# EAGLE design Actuator Circle (EAGLE 9.4.2)
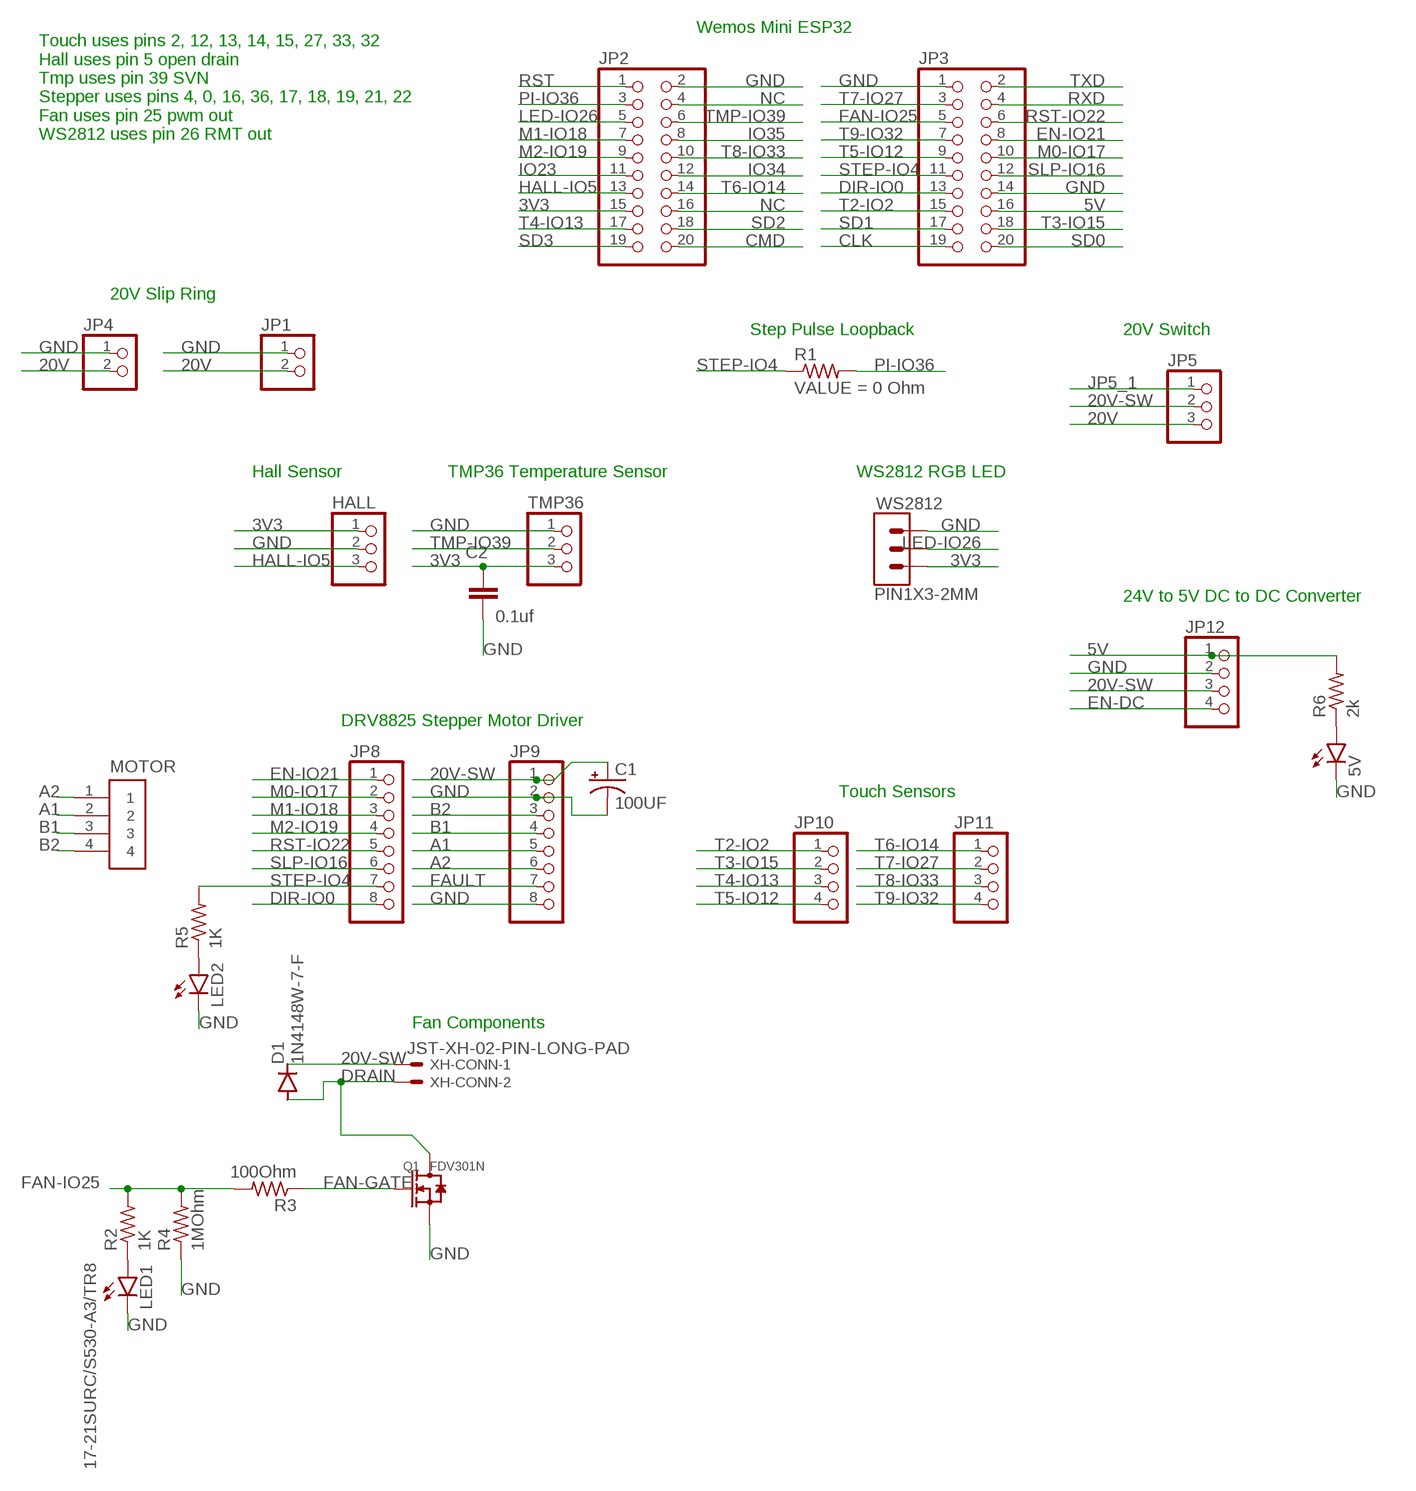
[diagram p0: schematic, sheet 1]

## Parts
5V  17-21SURC/S530-A3/TR8  LEDCHIPLED_0805  [CHIPLED_0805]
C1  100UF  CAPACITOR-PE2.5-6  [E2,5-6]
C2  0.1uf  CAP-0603-22UF-10V-MLCC  [CAP_0603]
D1  1N4148W-7-F  D-SOD123  [SOD123]
HALL  PINHD-1X3  [1X03]
JP1  PINHD-1X2  [1X02]
JP2  PINHD-2X10  [2X10]
JP3  PINHD-2X10  [2X10]
JP4  PINHD-1X2  [1X02]
JP5  PINHD-1X3/90  [1X03/90]
JP8  PINHD-1X8  [1X08]
JP9  PINHD-1X8  [1X08]
JP10  PINHD-1X4  [1X04]
JP11  PINHD-1X4  [1X04]
JP12  PINHD-1X4  [1X04]
LED1  17-21SURC/S530-A3/TR8  LEDCHIPLED_0805  [CHIPLED_0805]
LED2  17-21SURC/S530-A3/TR8  LEDCHIPLED_0805  [CHIPLED_0805]
MOTOR  B4B-PH-K-S(LF)(SN)  [JST_B4B-PH-K-S(LF)(SN)]
Q1  FDV301N  SMD-MOSFET-N-CH-25V-220MA-FDV301N(SOT-23)  [SOT23]
R1  0 Ohm  RES-0402  [RES_0402]
R2  1K  RES-0402  [RES_0402]
R3  100Ohm  RES-0402  [RES_0402]
R4  1MOhm  RES-0402  [RES_0402]
R5  1K  RES-0402  [RES_0402]
R6  2k  RES-0402  [RES_0402]
TMP36  PINHD-1X3  [1X03]
WS2812  PIN1X3-2MM  [PIN1X3-2MM]
XH-CONN  JST-XH-02-PIN-LONG-PAD  [JST-XH-02-PACKAGE-LONG-PAD]

## Nets
3V3: C2.1 HALL.1 JP2.15 TMP36.3 WS2812.3
5V: JP3.16 JP12.1 R6.2
20V: JP1.2 JP4.2 JP5.3
20V-SW: C1.+ D1.1(C) JP5.2 JP9.1 JP12.3 XH-CONN.1
A1: JP9.5 MOTOR.2
A2: JP9.6 MOTOR.1
B1: JP9.4 MOTOR.3
B2: JP9.3 MOTOR.4
CLK: JP3.19
CMD: JP2.20
DIR-IO0: JP3.13 JP8.8
DRAIN: D1.2(A) Q1.3(D) XH-CONN.2
EN-DC: JP12.4
EN-IO21: JP3.8 JP8.1
FAN-GATE: Q1.1(G) R3.1
FAN-IO25: JP3.5 R2.2 R3.2 R4.2
FAULT: JP9.7
GND [gndplane]: 5V.C C1.- C2.2 HALL.2 JP1.1 JP2.2 JP3.1 JP3.14 JP4.1 JP9.2 JP9.8 JP12.2 LED1.C LED2.C Q1.2(S) R4.1 TMP36.1 WS2812.1
HALL-IO5: HALL.3 JP2.13
IO23: JP2.11
IO34: JP2.12
IO35: JP2.8
JP5_1: JP5.1
LED-IO26: JP2.5 WS2812.2
M0-IO17: JP3.10 JP8.2
M1-IO18: JP2.7 JP8.3
M2-IO19: JP2.9 JP8.4
N$1: LED1.A R2.1
N$2: LED2.A R5.1
N$3: 5V.A R6.1
NC: JP2.4 JP2.16
PI-IO36: JP2.3 R1.2
RST: JP2.1
RST-IO22: JP3.6 JP8.5
RXD: JP3.4
SD0: JP3.20
SD1: JP3.17
SD2: JP2.18
SD3: JP2.19
SLP-IO16: JP3.12 JP8.6
STEP-IO4: JP3.11 JP8.7 R1.1 R5.2
T2-IO2: JP3.15 JP10.1
T3-IO15: JP3.18 JP10.2
T4-IO13: JP2.17 JP10.3
T5-IO12: JP3.9 JP10.4
T6-IO14: JP2.14 JP11.1
T7-IO27: JP3.3 JP11.2
T8-IO33: JP2.10 JP11.3
T9-IO32: JP3.7 JP11.4
TMP-IO39: JP2.6 TMP36.2
TXD: JP3.2

## Notes on the sheet
- Wemos Mini ESP32
- Touch uses pins 2, 12, 13, 14, 15, 27, 33, 32
  Hall uses pin 5 open drain
  Tmp uses pin 39 SVN
  Stepper uses pins 4, 0, 16, 36, 17, 18, 19, 21, 22
  Fan uses pin 25 pwm out
  WS2812 uses pin 26 RMT out
- 20V Slip Ring
- Step Pulse Loopback | 20V Switch
- Hall Sensor | TMP36 Temperature Sensor | WS2812 RGB LED
- 24V to 5V DC to DC Converter
- DRV8825 Stepper Motor Driver
- Touch Sensors
- Fan Components

## Library data of the parts
5V LED1 LED2 = Actuator Circle:LED: LED OSRAM: - CHIPLED LG R971, LG N971, LY N971, LG Q971, LY Q971, LO R971, LY R971 LH N974, LH R974 LS Q976, LO Q976, LY Q976 LO Q996 - Hyper CHIPLED LW Q18S LB Q993, LB Q99A, LB R99A - SideLED LS A670, LO A670, LY A670, LG A670, LP A670 LB A673, LV A673, LT A673, LW A673 LH A674 LY A675 LS A676, LA A676, LO A676, LY A676, LW A676 LS A679, LY A679, LG A679 - Hyper Micro SIDELED® LS Y876, LA Y876, LO Y876, LY Y876 LT Y87S - SmartLED LW L88C, LW L88S LB L89C, LB L89S, LG L890 LS L89K, LO L89K, LY L89K LS L896, LA L896, LO L896, LY L896 - TOPLED LS T670, LO T670, LY T670, LG T670, LP T670 LSG T670, LSP T670, LSY T670, LOP T670, LYG T670 LG T671, LOG T671, LSG T671 LB T673, LV T673, LT T673, LW T673 LH T674 LS T676, LA T676, LO T676, LY T676, LB T676, LH T676, LSB T676, LW T676 LB T67C, LV T67C, LT T67C, LS T67K, LO T67K, LY T67K, LW E67C LS E67B, LA E67B, LO E67B, LY E67B, LB E67C, LV E67C, LT E67C LW T67C LS T679, LY T679, LG T679 LS T770, LO T770, LY T770, LG T770, LP T770 LB T773, LV T773, LT T773, LW T773 LH T774 LS E675, LA E675, LY E675, LS T675 LS T776, LA T776, LO T776, LY T776, LB T776 LHGB T686 LT T68C, LB T68C - Hyper Mini TOPLED® LB M676 - Mini TOPLED Santana® LG M470 LS M47K, LO M47K, LY M47K Source: http://www.osram.convergy.de LUXEON: - LUMILED® LXK2-PW12-R00, LXK2-PW12-S00, LXK2-PW14-U00, LXK2-PW14-V00 LXK2-PM12-R00, LXK2-PM12-S00, LXK2-PM14-U00 LXK2-PE12-Q00, LXK2-PE12-R00, LXK2-PE12-S00, LXK2-PE14-T00, LXK2-PE14-U00 LXK2-PB12-K00, LXK2-PB12-L00, LXK2-PB12-M00, LXK2-PB14-N00, LXK2-PB14-P00, LXK2-PB14-Q00 LXK2-PR12-L00, LXK2-PR12-M00, LXK2-PR14-Q00, LXK2-PR14-R00 LXK2-PD12-Q00, LXK2-PD12-R00, LXK2-PD12-S00 LXK2-PH12-R00, LXK2-PH12-S00 LXK2-PL12-P00, LXK2-PL12-Q00, LXK2-PL12-R00 Source: www.luxeon.com KINGBRIGHT: KA-3528ASYC Source: www.kingbright.com
C1 = BeagleBone_Blue_R3:CAPACITOR-P: POLARIZED CAPACITOR, American symbol
C2 = Actuator Circle:CAP-0603-22UF-10V-MLCC: Multilayer Ceramic Capacitors MLCC - SMD/SMT 22uF 10V 0603 RoHS LCSC LINK <https://lcsc.com/product-detail/Multilayer-Ceramic-Capacitors-MLCC-SMD-SMT_SAMSUNG_CL10A226MP8NUNE_22uF-226-20-10V_C86295.html>; CREATED_BY: ChiliPeppr; DIGIKEY_PART_NUMBER: LCSC Part #: C86295; MANUFACTURER: Samsung Electro-Mechanics; MPN: CL10A226MP8NUNE; PACKAGE: SMD 0603
D1 = Actuator Circle:D-: DIODE unfilled
HALL TMP36 = pinhead:PINHD-1X3: PIN HEADER
JP1 JP4 = pinhead:PINHD-1X2: PIN HEADER
JP2 JP3 = pinhead:PINHD-2X10: PIN HEADER
JP5 = Actuator Circle:PINHD-1X3: PIN HEADER
JP8 JP9 = pinhead:PINHD-1X8: PIN HEADER
JP10-JP12 = pinhead:PINHD-1X4: PIN HEADER
MOTOR = B4B-PH-K-S_LF__SN_:B4B-PH-K-S(LF)(SN): PH Series 4 Position 2 mm Pitch Through Hole Crimp Top Entry Shrouded Header; AVAILABILITY: Unavailable; DESCRIPTION: PH Series 4 Position 2 mm Pitch Through Hole Crimp Top Entry Shrouded Header; MF: JST Sales; MP: B4B-PH-K-S_LF__SN_; PACKAGE: None; PRICE: None
Q1 = Actuator Circle:SMD-MOSFET-N-CH-25V-220MA-FDV301N(SOT-23): FDV301N https://datasheet.lcsc.com/szlcsc/ON-Semicon-ON-FDV301N_C15310.pdf Package SOT-23(SOT-23-3) Manufacturer ON Semicon Brand Category International Brands FET Type N Trench Drain to Source Voltage(Vdss) 25V Continuous Drain Current (Id) @ 25°C 220mA Vgs(th) (Max) @ Id 1.06V @ 250uA Rds On (Max) @ Id, Vgs 4 Ω @ 400mA,4.5V Power Dissipation-Max (Ta) 350mW; MPN: FDV301N
R1 = robot actuator:RES-0402: RES SMD 0402; CREATED_BY: ChiliPeppr; PACKAGE: SMD 0402
R2-R6 = Actuator Circle:RES-0402: RES SMD 0402; CREATED_BY: ChiliPeppr; PACKAGE: SMD 0402
WS2812 = Actuator Circle:PIN1X3-2MM: THT Vertical Pin Header WR-PHD, Pitch 2.00 mm, Single Row, 3 pins Manufacturer's datasheet <https://datasheet.octopart.com/62000311121-W%C3%BCrth-Elektronik-datasheet-117282002.pdf>; CREATED_BY: PCBLayout.com; MANUFACTURER: Würth Elektronik; MPN: 62000311121
XH-CONN = Actuator Circle:JST-XH-02-PIN: JST XH Connector 2 Pin Wire to board connector. Pitch: 2,54 mm, (0.100") Number of pins: 2 Created by Rembrandt Electronics www.rembrandtelectronics.com

## Net classes
1 gndplane: clearance 0.152 mm

## Board
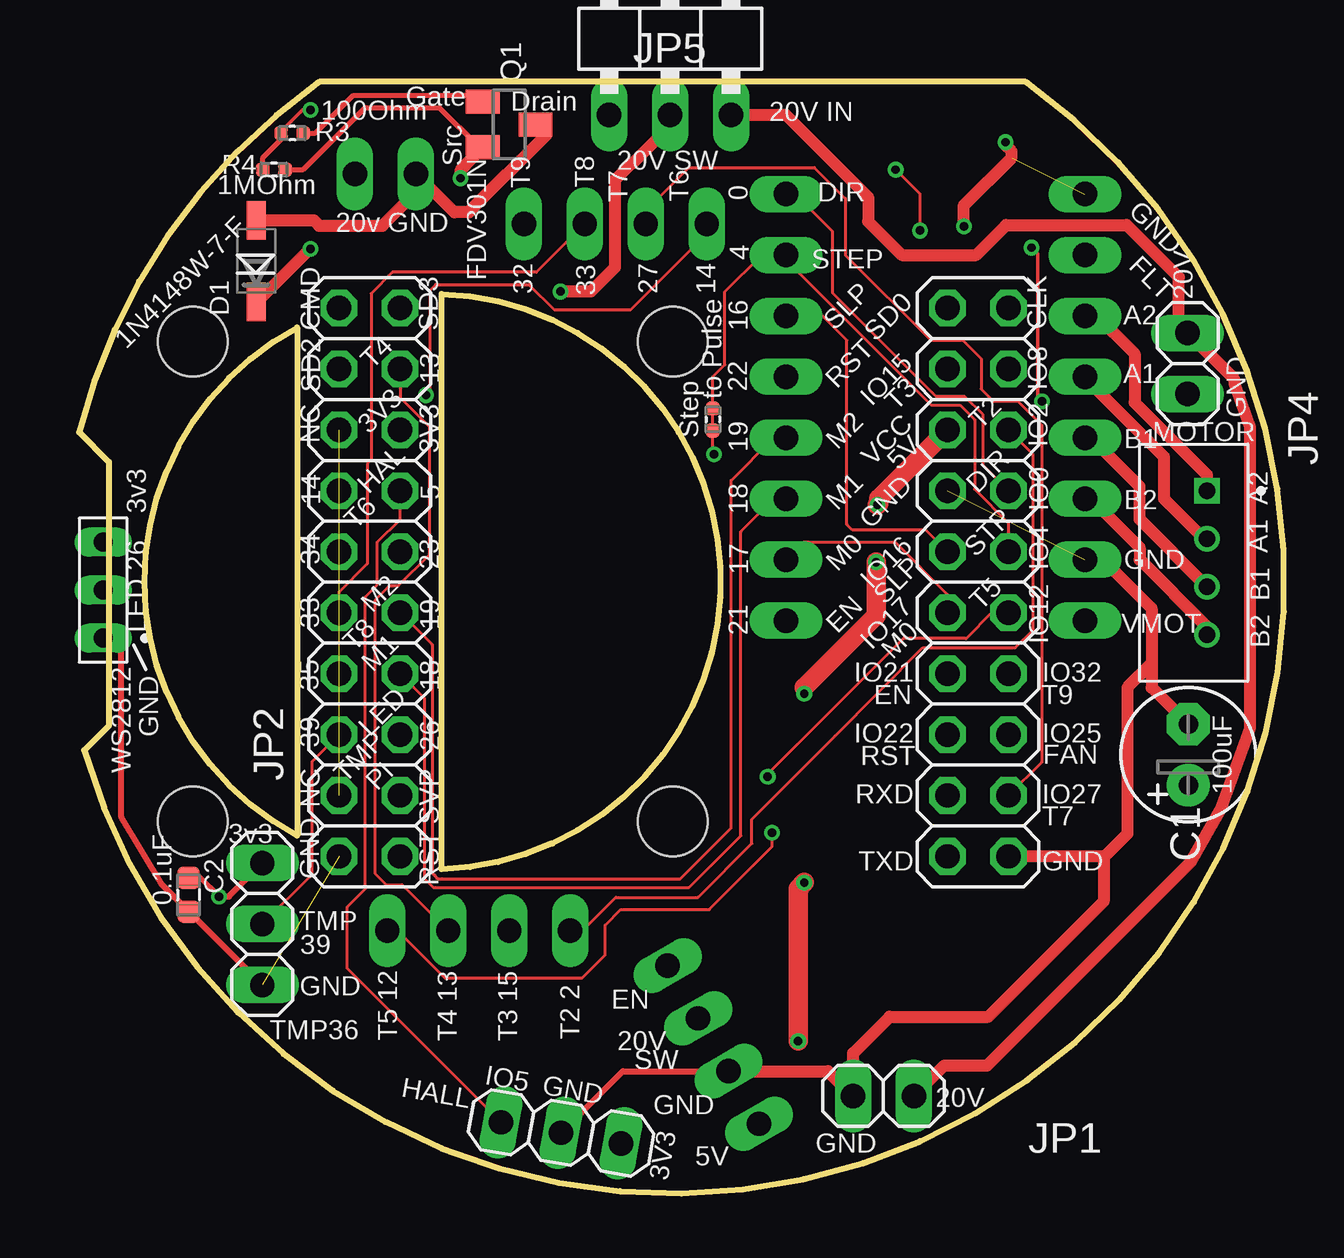
[diagram p1: board, top side]
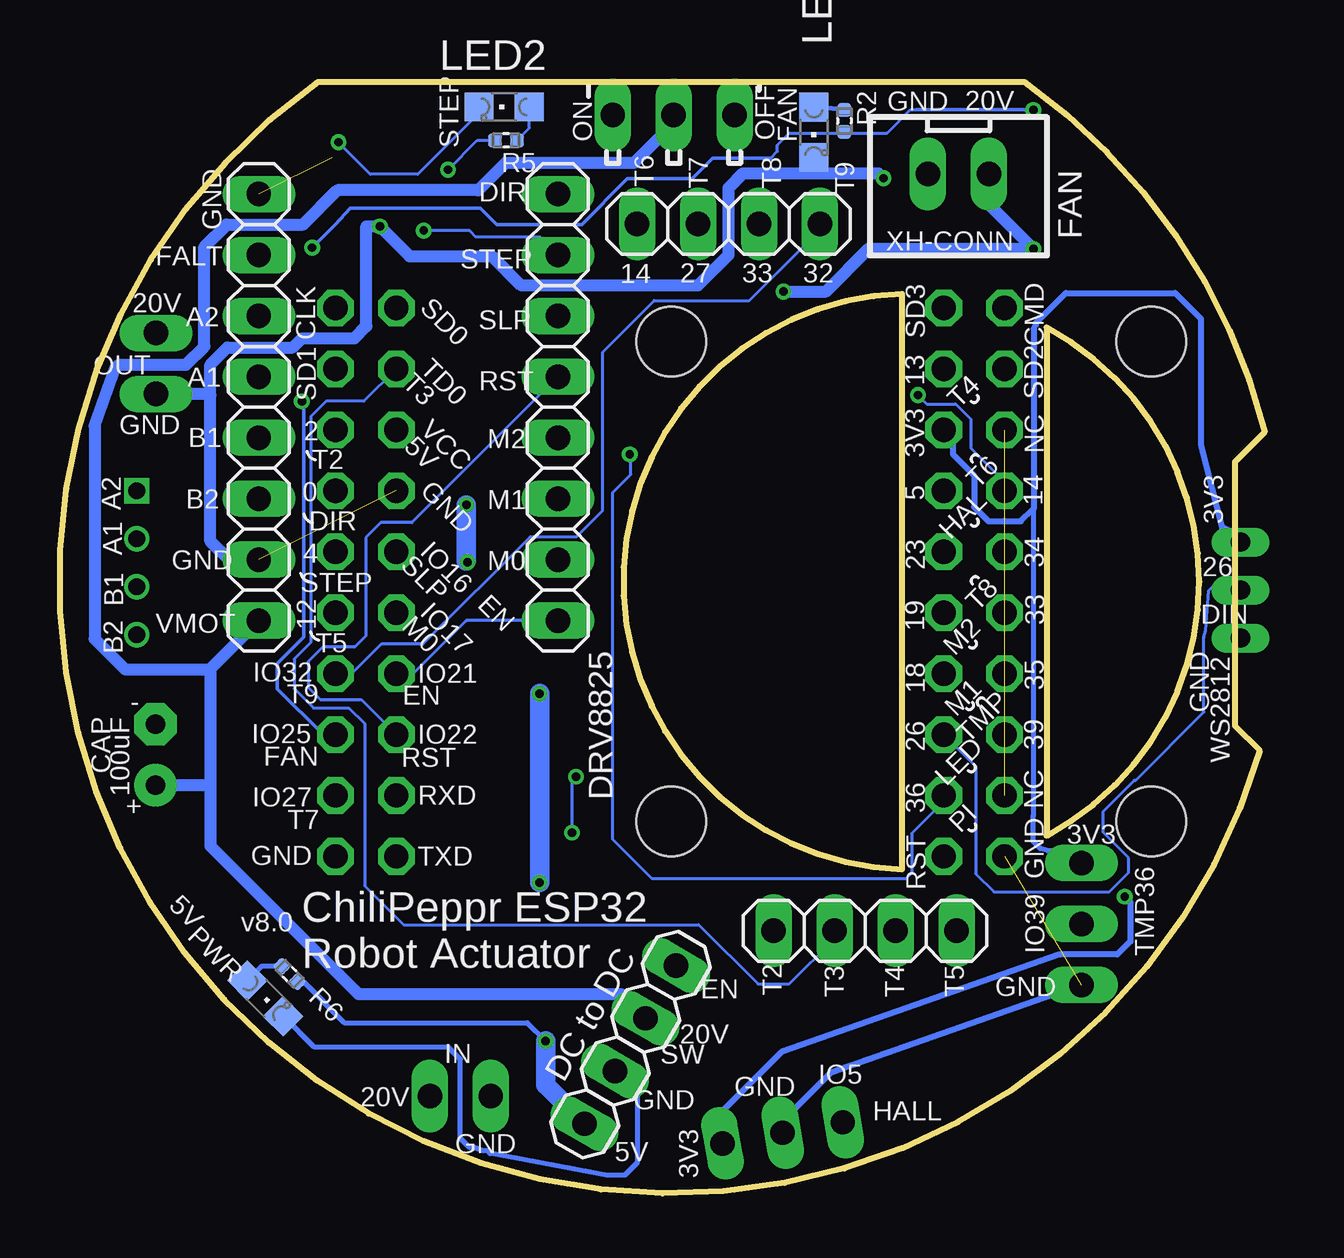
[diagram p2: board, bottom side, seen from below]

Size 50.2 x 46.32 mm. Coordinates in mm from the lower left corner, seen from the top.
Outline: 10.02,46.32 arc41 0,31.73 1.24,30.49 1.24,19.49 0.21,18.47 arc219 39.44,46.32 10.02,46.32
Outline: 9.08,14.91 arc-124 9.08,36.09 9.08,14.91
Outline: 15.11,37.49 arc-176 15.11,13.5 15.11,37.49
Copper layers (1*16): Top 0.035mm / dielectric 0.93mm / Bottom 0.035mm
Design rules "default *": minimum track width 5mil, minimum drill 0.3mm, track to track 5mil, track to pad 5mil, pad to pad 5mil, via to via 5mil, smd to smd 5mil, copper to edge 0.2mm, drill to drill 6mil, minimum pad ring 6mil, minimum via ring 6mil, stop-mask expansion 4mil, vias tented up to drill 0mil, thermal gap 10mil
Holes 2.9 mm at 4.73,15.5 24.73,15.5 4.73,35.5 24.73,35.5

### Footprints (pad centres in the part's own frame; a part is rotated, then mirrored left to right if it is on the bottom)
CHIPLED_0805 = smd 1.2 x 1.2: A 0,-1.05; C 0,1.05
E2,5-6 = drill 0.813 pad 1.778: + -1.27,0 | drill 0.813 pad 1.778 octagon: - 1.27,0
CAP_0603 = smd 0.92 x 0.93: 1 -0.705,0; 2 0.705,0
SOD123 = smd 1.6 x 0.8: 1 -1.7,0; 2 1.7,0
1X03 = drill 1.016 long: 1 -2.54,0; 2 0,0; 3 2.54,0
1X02 = drill 1.016 long: 1 -1.27,0; 2 1.27,0
2X10 = drill 1.016 octagon: 1 -11.43,-1.27; 2 -11.43,1.27; 3 -8.89,-1.27; 4 -8.89,1.27; 5 -6.35,-1.27; 6 -6.35,1.27; 7 -3.81,-1.27; 8 -3.81,1.27; 9 -1.27,-1.27; 10 -1.27,1.27; 11 1.27,-1.27; 12 1.27,1.27; 13 3.81,-1.27; 14 3.81,1.27; 15 6.35,-1.27; 16 6.35,1.27; 17 8.89,-1.27; 18 8.89,1.27; 19 11.43,-1.27; 20 11.43,1.27
1X03/90 = drill 1.016 long: 1 -2.54,-3.81; 2 0,-3.81; 3 2.54,-3.81
1X08 = drill 1.016 long: 1 -8.89,0; 2 -6.35,0; 3 -3.81,0; 4 -1.27,0; 5 1.27,0; 6 3.81,0; 7 6.35,0; 8 8.89,0
1X04 = drill 1.016 long: 1 -3.81,0; 2 -1.27,0; 3 1.27,0; 4 3.81,0
JST_B4B-PH-K-S(LF)(SN) = drill 0.7 square: 1 3,-0.55 | drill 0.7: 2 1,-0.55; 3 -1,-0.55; 4 -3,-0.55
SOT23 = smd 1 x 1.4: 1 -0.95,-1.1; 2 0.95,-1.1; 3 0,1.1
RES_0402 = smd 0.58 x 0.58: 1 -0.46,0; 2 0.46,0
PIN1X3-2MM = drill 0.8 long: 1 -2,0; 2 0,0; 3 2,0
JST-XH-02-PACKAGE-LONG-PAD = drill 1.016 long: 1 -1.27,0; 2 1.27,0

### Placement (x,y rotation side)
5V  41.64,8.12 225 bottom
C1  46.22,18.28 90 top
C2  4.56,12.44 270 top
D1  7.38,38.86 90 top
HALL  20.08,2.52 170 top
JP1  33.52,4.06 0 top
JP2  12.1,25.47 90 top
JP3  37.45,25.47 90 top
JP4  46.19,34.59 90 top
JP5  24.63,48.76 0 top
JP8  29.45,32.76 90 bottom
JP9  41.91,32.76 90 bottom
JP10  16.65,10.94 0 bottom
JP11  22.34,40.41 0 bottom
JP12  26.43,6.19 60 bottom
LED1  18.79,44.23 180 bottom
LED2  31.69,45.29 90 bottom
MOTOR  46.45,26.29 90 top
Q1  17.92,44.55 270 top
R1  26.41,32.25 270 top
R2  17.52,44.7 270 bottom
R3  8.88,44.19 180 top
R4  8.12,42.67 180 top
R5  31.61,43.89 180 bottom
R6  40.63,9.14 315 bottom
TMP36  7.63,11.22 90 top
WS2812  1,25.14 90 top
XH-CONN  12.77,42.49 180 bottom

### Tracks (layer width: path | path; a pad name or v marks a point on that pad's centre or on a via)
3V3  (via drill 0.35)
  Top 0.203: v5.83,12.37 5.05,13.15 C2.1
  Top 0.254: TMP36.3 6.24,12.37 v5.83,12.37
  Bottom 0.203: WS2812.3 1.54,27.68 1.77,27.68 | 9.64,28.53 9.64,15.74 9.65,15.74 9.65,14.66 9.36,14.37 9.03,14.27 8.14,14.27 TMP36.3
  Bottom 0.254: JP2.15 12.99,31.44 12.99,30.8 12.11,29.92 12.11,28.61 11.51,28.01 10.16,28.01 9.64,28.53 9.61,28.56 9.61,36.02 9.62,36.04 9.54,36.2 9.54,36.27 9.45,36.36 9.4,36.47 9.33,36.49 8.29,37.53 3.74,37.53 2.66,36.45 2.66,31.19 1.77,27.68 1.69,27.61 1.69,27.66 | 1.69,27.66 1.69,27.73 1.77,27.73 1.69,27.66 | HALL.1 22.59,3.44 20.13,5.89 8.54,9.95 6.15,9.95 5.6,10.5 5.6,12.14 v5.83,12.37
5V  (via drill 0.35)
  Top 0.254: 30.21,21.08 v30.21,20.82
  Top 0.813: JP3.16 33.31,28.95 33.31,28.75 v33.26,28.7 | v33.21,26.31 33.21,24.08 30.21,21.08 | v30.21,12.95 29.96,12.7 v29.96,6.35
  Bottom 0.203: R6.2 40.05,8.82 38.34,7.11 30.72,7.11 v29.96,6.35
  Bottom 0.508: 33.26,26.36 v33.21,26.31
  Bottom 0.813: v33.26,28.7 33.26,26.36 | v30.21,20.82 v30.21,12.95 | v29.96,6.35 29.96,4.52 JP12.1
20V
  Top 0.508: JP5.3 29.45,44.95 32.88,41.53 32.88,40.51 34.28,39.11 37.38,39.11 38.62,40.36 43.65,40.36 45.82,38.19 45.82,36.23 JP4.2 48.14,33.91 48.14,33.74 48.8,31.94 48.8,19.39 47.61,16.1 46.29,13.79 37.83,5.33 36.06,5.33 JP1.2
20V-SW  (via drill 0.35)
  Top 0.508: JP5.2 24.63,44.5 23.05,42.92 23.01,42.92 22.32,42.23 22.32,38.59 21.32,37.59 v20.05,37.59 | v9.64,39.37 7.43,37.16 D1.1
  Bottom 0.508: JP5.2 24.63,44.61 26.29,42.95 31.64,42.95 32.78,41.8 38.63,41.8 40.06,40.38 43.26,40.38 44.18,39.46 44.18,35.3 44.95,34.54 47.74,34.54 47.89,34.39 48.76,32 48.76,23.11 47.49,21.84 43.93,21.84 | 43.93,21.84 43.93,17.01 | 43.93,17.01 43.93,14.47 37.77,8.31 26.81,8.31 JP12.3 | JP9.1 43.93,21.85 43.93,21.84 | XH-CONN.1 11.5,41.22 v9.64,39.37 16.5,39.37 18.28,37.59 v20.05,37.59 | C1.+ 43.93,17.01
A1
  Top 0.508: JP9.5 41.91,33.99 45.2,30.71 45.2,28.95 46.87,27.29 MOTOR.2
A2
  Top 0.508: JP9.6 42.4,36.57 43.06,35.91 43.07,35.91 43.98,35 43.98,32.97 47,29.95 MOTOR.1
B1
  Top 0.508: MOTOR.3 44.18,28.1 44.18,29.46 42.15,31.49 JP9.4
B2
  Top 0.508: JP9.3 42.15,28.95 44.18,26.92 44.18,26.41 47,23.6 MOTOR.4
DIR-IO0
  Top 0.127: JP3.13 37.67,30.34 37.67,32.45 36.91,33.21 35.72,33.21 31.4,37.53 31.4,40.09 29.84,41.65 JP8.8
DRAIN
  Top 0.508: D1.2 9.78,40.56 10.01,40.33 12.64,40.33 14.04,41.73 XH-CONN.2 15.64,40.89 16.25,40.89 19.45,44.09 Q1.3
EN-IO21
  Bottom 0.127: JP8.1 33.26,23.87 35.47,21.66 JP3.8
FAN-GATE
  Top 0.203: R3.1 9.85,44.19 11.4,45.74 16.61,45.74 Q1.1
FAN-IO25  (via drill 0.35)
  Top 0.152: R3.2 8.42,44.27 9.31,45.16 v9.64,45.16 | v39.69,39.42 39.94,39.16 39.94,33.19 v40.12,33.02
  Top 0.203: R4.2 7.66,43.18 8.42,43.94 R3.2
  Bottom 0.127: 20.59,43.15 20.31,43.43 20.31,43.68 19.8,44.19 17.52,44.19 | 17.52,44.19 15.74,44.19 14.77,45.16 14.52,45.16 | R2.2 17.52,44.19
  Bottom 0.152: 14.52,45.16 v9.64,45.16 | 20.59,43.15 23,43.15 23.86,42.29 26.55,42.29 28.46,40.38 31.99,40.38 32.68,41.07 38.1,41.07 38.72,40.38 v39.69,39.42 | v40.12,33.02 40.04,32.94 40.04,23.19 41.14,22.09 41.14,21.03 39.23,19.12 JP3.5
GND  (via drill 0.35)  (3 unrouted)
  Top 0.203: WS2812.1 1.44,23.14 1.69,23.4 | R4.1 9.33,42.67 11.92,45.26 15.02,45.26 16.63,43.64 Q1.2 | C2.2 3.96,12.33 3.96,12.35
  Top 0.254: TMP36.1 3.96,12.35 3.46,12.86 1.77,15.68 1.77,23.36 1.73,23.4 1.69,23.4 | HALL.2 22.66,5.09 JP12.2
  Top 0.508: JP12.2 31.21,5.09 JP1.1 32.25,5.84 33.77,7.36 37.89,7.36 42.69,12.16 42.69,13.99 42.74,14.04 | 42.74,14.04 JP3.1 | JP9.2 42.66,26.41 44.69,24.38 44.69,22.09 | 44.69,22.09 43.68,21.08 43.68,14.98 42.74,14.04 | v15.89,42.31 15.89,42.62 Q1.2 | v36.87,40.31 36.87,41.2 38.85,43.18 38.85,43.43 38.6,43.68 v38.6,43.81 | 44.69,22.09 44.69,21.08 C1.-
  Bottom 0.127: LED2.C 32.74,45.03 35.29,42.48 37.26,42.48 v38.6,43.81 | LED1.C 18.79,42.52
  Bottom 0.203: JP12.2 26.15,4.18 26.15,1.27 26.66,0.76 27.42,0.76 32.27,1.66 | 32.27,1.66 32.31,1.67 | 40.65,7.38 40.88,7.38 | 40.88,7.38 5V.C | 32.27,1.66 32.38,1.77 32.6,1.77 32.96,1.91 33.14,1.91 33.52,2.28 33.52,5.58 34.02,6.09 39.59,6.09 40.88,7.38
  Bottom 0.254: TMP36.1 18.07,5.03 20.09,3.01 HALL.2
  Bottom 0.508: JP9.2 43.17,26.41 43.93,27.17 43.93,33.27 | 43.93,33.27 43.93,34.54 43.22,35.25 40.5,35.25 40.11,35.65 37.92,35.65 37.43,36.14 37.43,40.31 v36.87,40.31 35.62,39.06 32.2,39.06 30.98,37.84 23.62,37.84 22.34,39.12 22.34,41.91 21.73,42.52 18.79,42.52 16.09,42.52 v15.89,42.31 | 43.93,33.27 43.98,33.32 JP4.1
HALL-IO5
  Top 0.127: JP2.13 13.38,28.09 12.42,27.14 12.42,25.36 11.91,24.85 11.93,12.7 11.17,11.93 11.17,9.38 HALL.3
LED-IO26
  Bottom 0.127: JP2.5 12.04,17.79 12.04,13.32 11.28,12.56 6.48,12.56 5.67,13.37 5.67,13.98 6.72,15.03 6.72,15.93 5.44,17.21 5.38,17.21 2.54,20.05 2.54,23.16 2.46,23.45 2.32,25.13 2.08,25.37 1.23,25.37 WS2812.2
M0-IO17
  Top 0.127: JP3.10 36.18,24.96 34.02,27.12 30.16,27.12 JP8.2
M1-IO18
  Top 0.127: JP2.7 14.38,20.66 14.38,13.13 14.76,12.75 25.42,12.75 27.57,14.9 27.57,27.58 28.95,28.95 JP8.3
M2-IO19
  Top 0.127: JP2.9 14.71,22.87 14.71,13.35 14.72,13.34 14.72,13.33 14.83,13.22 14.94,13.11 14.95,13.11 14.96,13.11 15.11,13.11 25.05,13.11 27.17,15.23 27.17,29.71 28.95,31.49 JP8.4
N$1
  Bottom 0.203: R2.1 LED1.A
N$2
  Bottom 0.127: R5.1 30.64,44.4 LED2.A
N$3
  Bottom 0.203: R6.1 41.79,9.47 5V.A
NC  (1 unrouted)
PI-IO36  (via drill 0.35)
  Top 0.127: v26.46,30.81 26.41,30.86 R1.2 26.41,32.66
  Bottom 0.127: JP2.3 13.38,16.33 14.71,14.99 14.71,13.35 14.72,13.34 14.72,13.33 14.83,13.22 14.94,13.11 14.95,13.11 14.96,13.11 15.11,13.11 25.53,13.11 27.17,14.75 27.17,29.21 26.41,29.97 26.41,30.76 v26.46,30.81
RST-IO22
  Bottom 0.127: JP8.5 35.54,27.95 36.83,27.95 37.45,27.33 37.45,23.24 37.92,22.77 39.25,22.77 39.85,22.16 39.85,21.09 39.35,20.58 37.64,20.58 JP3.6
SLP-IO16
  Top 0.127: JP3.12 35.27,27.66 32.22,27.66 31.99,27.89 31.99,35.56 30.98,36.57 JP8.6
STEP-IO4  (via drill 0.35)
  Top 0.127: JP3.11 38.72,27.94 37.31,29.35 37.31,32.24 36.71,32.85 35.51,32.85 29.45,38.91 JP8.7 28.44,39.11 26.91,37.59 26.91,34.54 26.41,34.03 R1.1 | v35.04,40.13 35.04,41.65 v34.02,42.67
  Bottom 0.127: JP8.7 30.2,39.86 32.86,39.86 33.13,40.13 v35.04,40.13 | v34.02,42.67 32.81,43.89 R5.2
T2-IO2
  Top 0.127: JP10.1 20.97,10.94 22.37,12.34 25.8,12.34 28.03,14.58 28.03,15.59 31.49,19.05 35.16,22.74 39.02,22.74 39.75,23.48 39.75,30.79 JP3.15
T3-IO15
  Bottom 0.127: JP3.18 37.53,33.02 39.1,33.02 39.74,32.38 39.74,22.96 40.44,22.26 40.44,21.04 39.63,20.23 38.16,20.23 37.5,19.58 37.5,12.82 35.88,11.2 23.59,11.2 21.11,8.72 19.81,8.72 17.92,10.61 JP10.2
T4-IO13
  Top 0.127: JP2.17 13.38,33.17 14.58,31.96 14.58,26.6 13.29,25.31 12.93,25.31 12.32,24.7 12.32,13.34 12.8,12.86 13.46,12.86 JP10.3
T5-IO12  (via drill 0.35)
  Top 0.127: JP10.4 13.27,10.94 15.24,8.98 20.96,8.98 21.92,9.94 21.92,11.18 22.58,11.83 26.26,11.83 28.87,14.44 v28.87,15.03 | JP3.9 38.04,24.2 36.96,23.12 34.34,23.12 28.69,17.47 v28.69,17.37
  Bottom 0.127: v28.69,17.37 28.87,17.19 v28.87,15.03
T6-IO14  (via drill 0.35)
  Top 0.127: v14.45,33.27 14.47,33.27 14.61,33.41 14.61,37.64 14.86,37.89 18.74,37.89 19.8,36.83 22.98,36.83 26.15,40 JP11.1
  Bottom 0.127: JP2.14 10.84,29.65 12.25,31.06 12.25,32.27 12.88,32.9 14.08,32.9 v14.45,33.27
T7-IO27
  Top 0.127: JP11.2 23.61,40.97 25.4,42.76 30.64,42.76 31.93,41.46 31.93,39.1 35.48,35.56 36.82,35.56 37.58,34.79 37.58,33.52 38.09,33.02 39.11,33.02 40.11,32.01 40.11,17.97 JP3.3
T8-IO33
  Top 0.127: JP11.3 19.06,38.39 13.05,38.39 12.17,37.51 12.17,30.59 12.18,30.58 12.02,30.41 12.02,26.25 10.84,25.07 JP2.10
T9-IO32
  Bottom 0.127: JP11.4 18.53,40.15 21.48,37.21 25.44,37.21 27.59,35.06 27.59,28.46 28.68,27.37 30.61,27.37 35.08,22.89 36.81,22.89 38.04,21.66 JP3.7
TMP-IO39
  Top 0.127: TMP36.2 9.71,13.3 9.71,18 JP2.6

### Text on the board
tPlace: 100Ohm | Gate | Drain | 20V IN | Src | 20V SW | 1MOhm | T9 | T8 | DIR | 1N4148W-7-F | T7 | T6 | 0 | GND | 20v | GND | 32 | 33 | 27 | 14 | 4 | STEP | FLT | FDV301N | SD0 | 20V | CMD | SD3 | 16 | SLP | CLK | A2 | IO15 | T4 | 13 | RST | T3 | A1 | SD2 | to Pulse | 22 | IO8 | 3V3 | VCC | T2 | GND | NC | 3V3 | Step | 19 | M2 | 5V | IO2 | B1 | 3v3 | 5 | 14 | HAL | GND | DIR | B2 | A2 | T6 | 18 | M1 | IO0 | 23 | IO16 | A1 | 34 | 17 | M0 | SLP | STP | IO4 | GND | 19 | B1 | 33 | M2 | IO17 | T5 | LED 26 | T8 | 21 | EN | M0 | IO12 | VMOT | B2 | GND | M1 | 18 | 35 | IO21 | IO32 | 26 | EN | T9 | 39 | LED | IO22 | IO25 | SVP | RST | FAN | TMP | PI | 100uF | NC | RXD | IO27 | 3v3 | RST | T7 | GND | TXD | GND | 0.1uF | TMP | 39 | GND | EN | T5 12 | T4 13 | T3 15 | T2 2 | 20V | IO5 | GND | SW | 20V | GND | 3V3 | GND | 5V
bPlace: FAN | ON | 20V | GND | OFF | STEP | FAN | T9 | T8 | T7 | T6 | DIR | GND | 32 | 33 | 27 | 14 | STEP | FALT | CMD | SD3 | CLK | SLP | SD0 | 20V | A2 | SD2 | 13 | SD1 | T4 | RST | TD0 | A1 | OUT | 3V3 | T3 | NC | M2 | VCC | GND | 2 | B1 | 3V3 | 14 | T6 | 5 | 5V | T2 | A2 | HAL | M1 | GND | 0 | B2 | DIR | A1 | 26 | 34 | 23 | M0 | IO16 | 4 | GND | B1 | DIN | T8 | 19 | SLP | STEP | 12 | 33 | M2 | IO17 | B2 | DRV8825 | EN | T5 | VMOT | 18 | M0 | 35 | M1 | IO21 | IO32 | GND | TMP | 26 | EN | T9 | - | LED | IO22 | IO25 | WS2812 | 39 | RST | FAN | CAP | 36 | 100uF | NC | PI | RXD | IO27 | + | 3V3 | RST | T7 | TXD | GND | GND | IO39 | v8.0 | PWR | TMP36 | GND | ChiliPeppr ESP32 / Robot Actuator | T5 | T4 | T3 | T2 | EN | 20V | IO5 | SW | DC to DC | IN | GND | GND | 20V | HALL | GND | 3V3 | 5V